# EAGLE design ATtiny841_Basic4 (EAGLE 7.5.0)
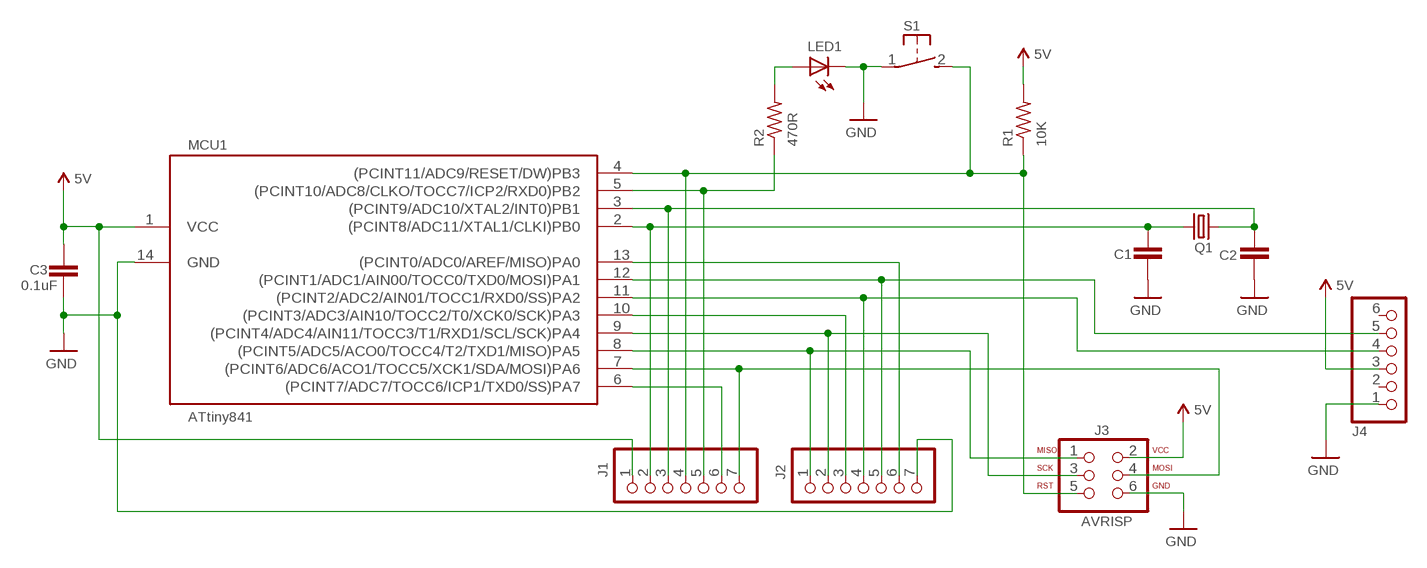
[diagram p0: schematic, sheet 1]

## Parts
C1  C-UNPOL  [CAP-PTH-SMALL2]
C2  C-UNPOL  [CAP-PTH-SMALL2]
C3  0.1uF  C-UNPOL  [CAP-PTH-SMALL2]
J1  PINHD-1X71X07-CLEANBIG  [1X07-CLEANBIG]
J2  PINHD-1X71X07-CLEANBIG  [1X07-CLEANBIG]
J3  AVRISP  [2X03-CLEAN]
J4  PINHD-1X6CB  [1X06-CLEANBIG]
LED1  LED5MM  [LED5MM]
MCU1  ATtiny841  ATTINY441/841-SSU  [SOIC14]
Q1  CRYSTALHC49S  [HC49/S]
R1  10K  RESISTOR-0207/V  [RESISTOR-0207/2V]
R2  470R  RESISTOR-0207/V  [RESISTOR-0207/2V]
S1  SW-SPST-TACT  [DTS-3]

## Nets
5V: C3.1 J1.1 J3.2 J4.3 MCU1.1(VCC) R1.2
GND: C1.2 C2.1 C3.2 J2.7 J3.6 J4.1 LED1.K(C) MCU1.14(GND) S1.1
MISO: J2.1 J3.1 MCU1.8((PCINT5/ADC5/ACO0/TOCC4/T2/TXD1/MISO)PA5)
MOSI: J1.7 J3.4 MCU1.7((PCINT6/ADC6/ACO1/TOCC5/XCK1/SDA/MOSI)PA6)
N$1: J1.6 MCU1.6((PCINT7/ADC7/TOCC6/ICP1/TXD0/SS)PA7)
N$2: C1.1 J1.2 MCU1.2((PCINT8/ADC11/XTAL1/CLKI)PB0) Q1.1
N$3: C2.2 J1.3 MCU1.3((PCINT9/ADC10/XTAL2/INT0)PB1) Q1.2
N$4: J2.6 MCU1.13((PCINT0/ADC0/AREF/MISO)PA0)
N$5: J2.3 MCU1.10((PCINT3/ADC3/AIN10/TOCC2/T0/XCK0/SCK)PA3)
N$10: J1.5 MCU1.5((PCINT10/ADC8/CLKO/TOCC7/ICP2/RXD0)PB2) R2.1
N$11: LED1.A R2.2
RST: J1.4 J3.5 MCU1.4((PCINT11/ADC9/RESET/DW)PB3) R1.1 S1.2
RTS: J2.5 J4.5 MCU1.12((PCINT1/ADC1/AIN00/TOCC0/TXD0/MOSI)PA1)
RXD0: J2.4 J4.4 MCU1.11((PCINT2/ADC2/AIN01/TOCC1/RXD0/SS)PA2)
SCK: J2.2 J3.3 MCU1.9((PCINT4/ADC4/AIN11/TOCC3/T1/RXD1/SCL/SCK)PA4)
Unconnected: J4.2 J4.6

## Library data of the parts
C1-C3 = AU2016:C-UNPOL
J1 J2 = AU2016:PINHD-1X7
J3 = AU2016:AVRISP
J4 = AU2016:PINHD-1X6: PIN HEADER
LED1 = AU2016:LED: LED OSRAM: - CHIPLED LG R971, LG N971, LY N971, LG Q971, LY Q971, LO R971, LY R971 LH N974, LH R974 LS Q976, LO Q976, LY Q976 LO Q996 - Hyper CHIPLED LW Q18S LB Q993, LB Q99A, LB R99A - SideLED LS A670, LO A670, LY A670, LG A670, LP A670 LB A673, LV A673, LT A673, LW A673 LH A674 LY A675 LS A676, LA A676, LO A676, LY A676, LW A676 LS A679, LY A679, LG A679 - Hyper Micro SIDELED® LS Y876, LA Y876, LO Y876, LY Y876 LT Y87S - SmartLED LW L88C, LW L88S LB L89C, LB L89S, LG L890 LS L89K, LO L89K, LY L89K LS L896, LA L896, LO L896, LY L896 - TOPLED LS T670, LO T670, LY T670, LG T670, LP T670 LSG T670, LSP T670, LSY T670, LOP T670, LYG T670 LG T671, LOG T671, LSG T671 LB T673, LV T673, LT T673, LW T673 LH T674 LS T676, LA T676, LO T676, LY T676, LB T676, LH T676, LSB T676, LW T676 LB T67C, LV T67C, LT T67C, LS T67K, LO T67K, LY T67K, LW E67C LS E67B, LA E67B, LO E67B, LY E67B, LB E67C, LV E67C, LT E67C LW T67C LS T679, LY T679, LG T679 LS T770, LO T770, LY T770, LG T770, LP T770 LB T773, LV T773, LT T773, LW T773 LH T774 LS E675, LA E675, LY E675, LS T675 LS T776, LA T776, LO T776, LY T776, LB T776 LHGB T686 LT T68C, LB T68C - Hyper Mini TOPLED® LB M676 - Mini TOPLED Santana® LG M470 LS M47K, LO M47K, LY M47K Source: http://www.osram.convergy.de/
MCU1 = AU2016:ATTINY441/841: ATtiny441, ATtiny841 AVR Microcontroller The high-performance Atmel picoPower 8-bit AVR RISC-based microcontroller combines 4KB ISP flash memory, 512-Byte EEPROM, 128B SRAM, 12 general purpose I/O lines, 32 general purpose working registers, an 8-bit timer/counter with two PWM channels, two 16-bit timer/counters with two PWM channels, internal and external interrupts, an 12-channel 10-bit A/D converter, 2 On-chip analog comparators, 2 full duplex USARTs with Start Frame wake up from power down, master/slave SPI serial interface, slave I2C serial interface, programmable gain stage (1x, 20x, and 100x) for 12 differential ADC channel pairs, programmable watchdog timer with internal oscillator, internal calibrated oscillator, and four software selectable power saving modes. The device operates between 1.7-5.5 volts. datasheet.pdf <http://www.atmel.com/Images/Atmel-8495-8-bit-AVR-Microcontrollers-ATtiny441-ATtiny841_Datasheet.pdf>
Q1 = AU2016:CRYSTAL: CRYSTAL; OC_FARNELL: 1667008; OC_NEWARK: unknown
R1 R2 = AU2016:RESISTOR-0207/V
S1 = AU2016:SW-SPST-TACT

## Board
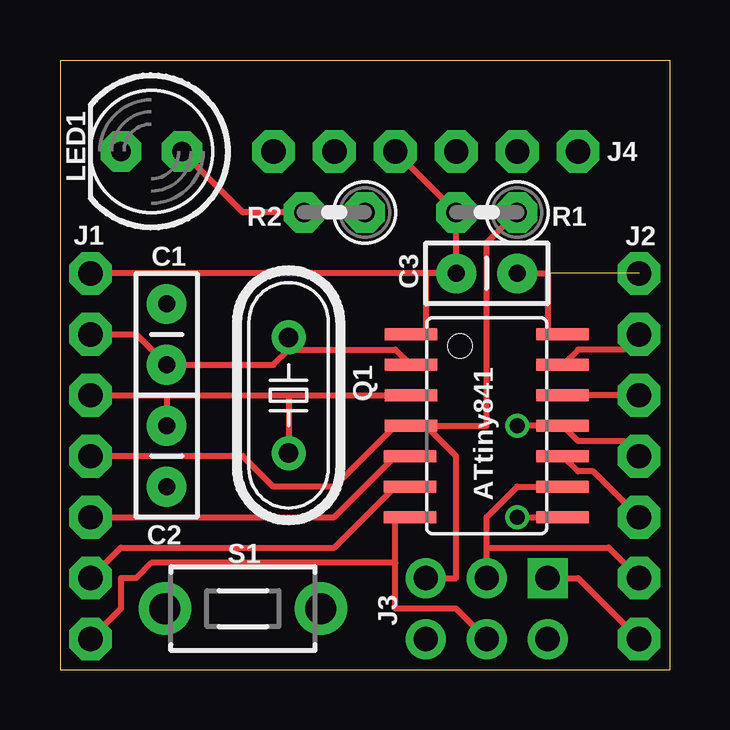
[diagram p1: board, top side]
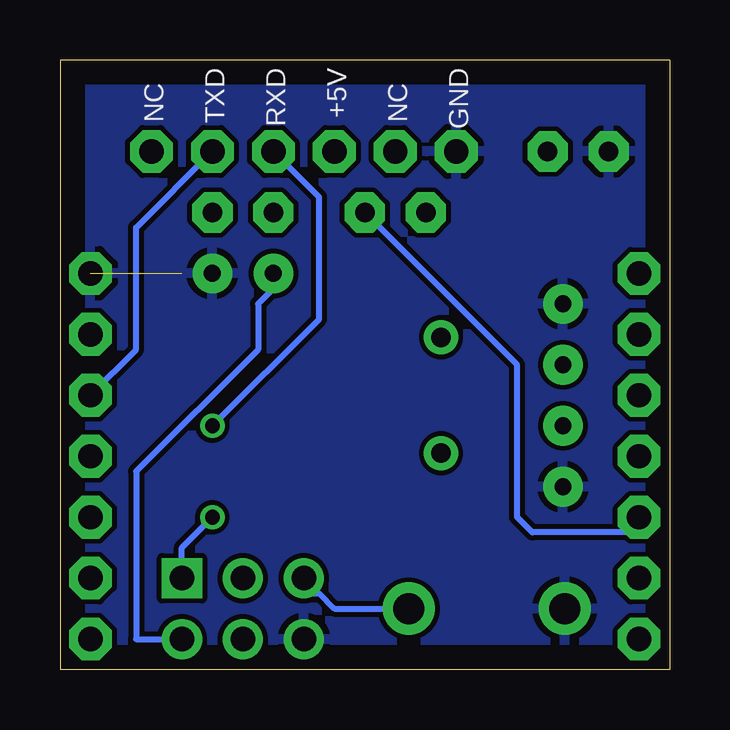
[diagram p2: board, bottom side, seen from below]

Size 25.4 x 25.4 mm. Coordinates in mm from the lower left corner, seen from the top.
Outline: 0,25.4 0,0 25.4,0 25.4,25.4 0,25.4
Copper layers (1*16): Top 0.035mm / dielectric 1.5mm / Bottom 0.035mm
Design rules "default *": minimum track width 10mil, minimum drill 24mil, track to track 8mil, track to pad 8mil, pad to pad 8mil, via to via 8mil, smd to smd 8mil, copper to edge 40mil, drill to drill 8mil, minimum pad ring 12mil, minimum via ring 8mil, stop-mask expansion 4mil, vias tented up to drill 0mil, thermal gap 10mil

### Footprints (pad centres in the part's own frame; a part is rotated, then mirrored left to right if it is on the bottom)
CAP-PTH-SMALL2 = drill 0.7 pad 1.651: 1 0,0; 2 2.54,0
1X07-CLEANBIG = drill 1.016 pad 1.778 octagon: 1 -6.35,0; 2 -3.81,0; 3 -1.27,0; 4 1.27,0; 5 3.81,0; 6 6.35,0; 7 8.89,0
2X03-CLEAN = drill 1.016 pad 1.676 square: 1 -1.27,2.54 | drill 1.016 pad 1.676: 2 1.27,2.54; 3 -1.27,0; 4 1.27,0; 5 -1.27,-2.54; 6 1.27,-2.54
1X06-CLEANBIG = drill 1.016 pad 1.778 octagon: 1 -6.35,0; 2 -3.81,0; 3 -1.27,0; 4 1.27,0; 5 3.81,0; 6 6.35,0
LED5MM = drill 0.813 pad 1.676 octagon: A -1.27,0; K 1.27,0
SOIC14 = smd 0.5 x 2.2: 1 -1.905,-3.154; 2 -0.645,-3.154; 3 0.625,-3.154; 4 1.895,-3.154; 5 3.175,-3.196; 6 4.445,-3.196; 7 5.715,-3.196; 8 5.715,3.154; 9 4.445,3.154; 10 3.175,3.154; 11 1.905,3.154; 12 0.635,3.154; 13 -0.635,3.154; 14 -1.905,3.154
HC49/S = drill 0.813: 1 -2.413,0; 2 2.413,0
RESISTOR-0207/2V = drill 0.813 pad 1.676 octagon: 1 -1.27,0; 2 1.27,0
DTS-3 = drill 1.3 pad 2.184: 1 -3.25,0; 2 3.25,0

### Placement (x,y rotation side)
C1  4.45,12.7 90 top
C2  4.45,7.62 90 top
C3  16.51,16.51 0 top
J1  1.27,10.16 270 top
J2  24.13,7.62 90 top
J3  17.78,2.54 270 top
J4  15.24,21.59 0 top
LED1  3.81,21.59 180 top
MCU1  17.78,12.06 270 top
Q1  9.53,11.43 270 top
R1  17.78,19.05 180 top
R2  11.43,19.05 180 top
S1  7.62,2.54 0 top

### Tracks (layer width: path | path; a pad name or v marks a point on that pad's centre or on a via)
5V
  Top 0.254: 15.24,16.51 15.24,13.97 MCU1.1 | 15.24,16.51 C3.1 R1.2 J4.3 | 15.24,16.51 J1.1
  Bottom 0.254: J3.2 22.23,1.27 22.23,8.26 17.14,13.34 17.14,15.24 16.51,15.88 C3.1
GND  (1 unrouted)
  Top 0.254: C3.2 20.32,16.51 20.32,13.97 MCU1.14
  pour Bottom: 0,0 25.4,0 25.4,25.4 0,25.4
MISO  (via drill 0.61)
  Top 0.254: v19.05,6.35 MCU1.8 | J2.1 21.59,3.81 J3.1
  Bottom 0.254: v19.05,6.35 20.32,5.08 J3.1
MOSI
  Top 0.254: 13.97,4.45 13.97,2.54 16.51,2.54 J3.4 | 13.97,4.45 13.97,6.35 MCU1.7 | J1.7 2.54,2.54 2.54,3.81 3.17,3.81 3.81,4.45 13.97,4.45
N$1
  Top 0.254: J1.6 2.54,5.08 11.43,5.08 13.97,7.62 MCU1.6
N$2
  Top 0.254: 9.53,13.34 13.97,13.34 14.61,12.7 MCU1.2 | J1.2 3.17,13.97 C1.1 8.89,12.7 9.53,13.34 | 9.53,13.34 Q1.1
N$3
  Top 0.254: J1.3 4.45,11.43 | 4.45,11.43 9.53,11.43 | 9.53,11.43 14.61,11.43 MCU1.3 | 9.53,11.43 Q1.2 | 4.45,11.43 C2.2
N$4
  Top 0.254: J2.6 23.5,13.34 21.59,13.34 20.95,12.7 MCU1.13
N$5
  Top 0.254: J2.3 22.23,8.26 21.59,8.26 20.95,8.89 MCU1.10
N$10
  Top 0.254: J1.5 11.43,6.35 13.97,8.89 MCU1.5
  Bottom 0.254: R2.1 6.35,12.7 6.35,6.35 5.71,5.71 1.27,5.71 J1.5
N$11
  Top 0.254: LED1.A 7.62,19.05 R2.2
RST
  Top 0.254: 15.24,10.16 16.51,8.89 16.51,3.81 J3.5 | R1.1 17.78,17.78 17.78,10.16 15.24,10.16 | 15.24,10.16 MCU1.4 14.61,10.16 13.97,10.16 11.43,7.62 8.89,7.62 7.62,8.89 J1.4
  Bottom 0.254: S1.2 13.97,2.54 14.61,3.17 15.24,3.17 J3.5
RTS
  Top 0.254: J2.5 MCU1.12
  Bottom 0.254: J4.5 22.23,18.41 22.23,13.34 J2.5
RXD0  (via drill 0.61)
  Top 0.254: J2.4 23.5,9.53 21.59,9.53 20.95,10.16 MCU1.11 v19.05,10.16
  Bottom 0.254: J4.4 14.61,19.68 14.61,14.61 v19.05,10.16
SCK
  Top 0.254: MCU1.9 19.05,7.62 17.78,6.35 17.78,5.08 | J3.3 17.78,5.08 | J2.2 22.86,5.08 17.78,5.08

### Text on the board
bNames: GND | +5V | RXD | TXD | NC | NC